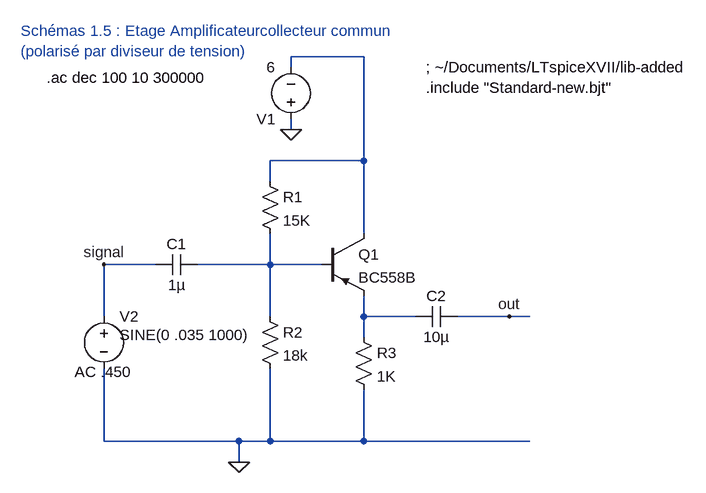
[diagram p0: schematic 1_5-CollecteurCommun.asc]
1_5-CollecteurCommun.asc, the LTspice schematic file:
Version 4
SHEET 1 1736 760
WIRE 880 64 768 64
WIRE 768 80 768 64
WIRE 768 176 768 160
WIRE 880 224 880 64
WIRE 880 224 736 224
WIRE 736 256 736 224
WIRE 880 336 880 224
WIRE 560 384 480 384
WIRE 736 384 736 336
WIRE 736 384 624 384
WIRE 816 384 736 384
WIRE 480 464 480 384
WIRE 736 464 736 384
WIRE 880 464 880 432
WIRE 960 464 880 464
WIRE 1104 464 1024 464
WIRE 1136 464 1104 464
WIRE 880 496 880 464
WIRE 480 656 480 544
WIRE 688 656 480 656
WIRE 736 656 736 544
WIRE 736 656 688 656
WIRE 880 656 880 576
WIRE 880 656 736 656
WIRE 1136 656 880 656
WIRE 688 688 688 656
FLAG 768 176 0
FLAG 688 688 0
FLAG 1104 464 out
FLAG 480 384 signal
SYMBOL voltage 768 176 R180
WINDOW 123 0 0 Left 0
WINDOW 39 0 0 Left 0
SYMATTR InstName V1
SYMATTR Value 6
SYMBOL voltage 480 448 R0
WINDOW 123 -45 101 Left 2
WINDOW 39 0 0 Left 0
WINDOW 3 24 44 Left 2
SYMATTR Value2 AC .450
SYMATTR Value SINE(0 .035 1000)
SYMATTR InstName V2
SYMBOL res 864 480 R0
SYMATTR InstName R3
SYMATTR Value 1K
SYMBOL cap 624 368 R90
WINDOW 0 0 32 VBottom 2
WINDOW 3 32 32 VTop 2
SYMATTR InstName C1
SYMATTR Value 1µ
SYMBOL res 720 448 R0
SYMATTR InstName R2
SYMATTR Value 18k
SYMBOL cap 1024 448 R90
WINDOW 0 0 32 VBottom 2
WINDOW 3 32 32 VTop 2
SYMATTR InstName C2
SYMATTR Value 10µ
SYMBOL pnp 816 336 R0
SYMATTR InstName Q1
SYMATTR Value BC558B
SYMBOL res 720 240 R0
SYMATTR InstName R1
SYMATTR Value 15K
TEXT 352 24 Left 2 ;Schémas 1.5 : Etage Amplificateurcollecteur commun\n(polarisé par diviseur de tension)
TEXT 392 96 Left 2 !.ac dec 100 10 300000
TEXT 976 80 Left 2 !; ~/Documents/LTspiceXVII/lib-added\n.include "Standard-new.bjt"

The netlist it stands for:
* 1_5-CollecteurCommun.asc
V1 0 N001 6
V2 signal 0 SINE(0 .035 1000) AC .450
R3 N003 0 1K
C1 N002 signal 1µ
R2 N002 0 18k
C2 out N003 10µ
Q1 N001 N002 N003 0 BC558B
R1 N001 N002 15K
.model NPN NPN
.model PNP PNP
.lib standard.bjt
* Schémas 1.5 : Etage Amplificateurcollecteur commun
* (polarisé par diviseur de tension)
.ac dec 100 10 300000
; ~/Documents/LTspiceXVII/lib-added
.include "Standard-new.bjt"
.backanno
.end